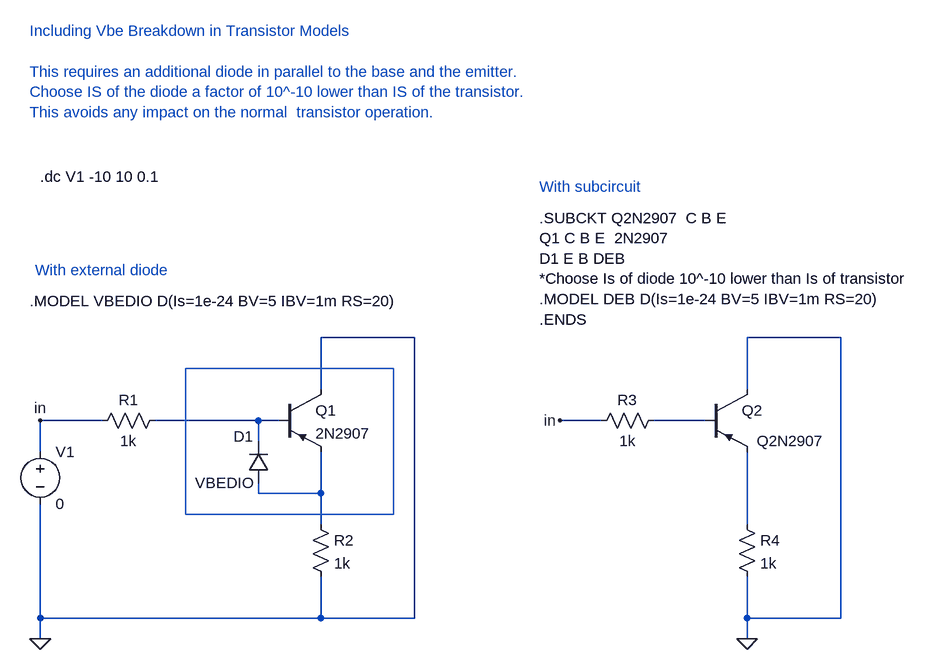
[diagram p0: schematic Vbe_break.asc]
Vbe_break.asc, the LTspice schematic file:
Version 4
SHEET 1 1480 744
WIRE 304 224 304 288
WIRE 304 480 -128 480
WIRE 208 208 208 176
WIRE 208 176 240 176
WIRE 208 176 48 176
WIRE -128 480 -128 304
WIRE -128 176 -128 224
WIRE -32 176 -128 176
WIRE -128 512 -128 480
WIRE 304 128 304 48
WIRE 304 48 448 48
WIRE 448 48 448 480
WIRE 448 480 304 480
WIRE 304 416 304 480
WIRE 208 272 208 288
WIRE 208 288 304 288
WIRE 304 288 304 336
WIRE 960 224 960 336
WIRE 816 176 896 176
WIRE 960 128 960 48
WIRE 960 48 1104 48
WIRE 1104 48 1104 480
WIRE 1104 480 960 480
WIRE 960 416 960 480
WIRE 736 176 672 176
WIRE 960 512 960 480
FLAG -128 512 0
FLAG -128 176 in
FLAG 672 176 in
FLAG 960 512 0
SYMBOL diode 224 272 R180
WINDOW 0 24 72 Left 0
WINDOW 3 24 0 Left 0
SYMATTR InstName D1
SYMATTR Value VBEDIO
SYMBOL pnp 240 128 R0
SYMATTR InstName Q1
SYMATTR Value 2N2907
SYMBOL voltage -128 208 R0
SYMATTR InstName V1
SYMATTR Value 0
SYMBOL res -48 192 R270
WINDOW 0 32 56 VTop 0
WINDOW 3 0 56 VBottom 0
SYMATTR InstName R1
SYMATTR Value 1k
SYMBOL res 288 320 R0
SYMATTR InstName R2
SYMATTR Value 1k
SYMBOL res 720 192 R270
WINDOW 0 32 56 VTop 0
WINDOW 3 0 56 VBottom 0
SYMATTR InstName R3
SYMATTR Value 1k
SYMBOL res 944 320 R0
SYMATTR InstName R4
SYMATTR Value 1k
SYMBOL pnp 896 128 R0
WINDOW 3 79 79 Left 0
SYMATTR Value Q2N2907
SYMATTR InstName Q2
SYMATTR Prefix X
TEXT -128 -200 Left 0 !.dc V1 -10 10 0.1
TEXT -144 -8 Left 0 !.MODEL VBEDIO D(Is=1e-24 BV=5 IBV=1m RS=20)
TEXT 640 -136 Left 0 !.SUBCKT Q2N2907  C B E\nQ1 C B E  2N2907\nD1 E B DEB\n*Choose Is of diode 10^-10 lower than Is of transistor\n.MODEL DEB D(Is=1e-24 BV=5 IBV=1m RS=20)\n.ENDS
TEXT -136 -56 Left 0 ;With external diode
TEXT 640 -184 Left 0 ;With subcircuit
TEXT -144 -424 Left 0 ;Including Vbe Breakdown in Transistor Models\n \nThis requires an additional diode in parallel to the base and the emitter.\nChoose IS of the diode a factor of 10^-10 lower than IS of the transistor. \nThis avoids any impact on the normal  transistor operation.
RECTANGLE Normal 416 320 96 96

The netlist it stands for:
* Vbe_break.asc
D1 N001 N002 VBEDIO
Q1 0 N002 N001 0 2N2907
V1 in 0 0
R1 in N002 1k
R2 N001 0 1k
R3 in N004 1k
R4 N003 0 1k
XQ2 0 N004 N003 Q2N2907  ; pins C B E
.model D D
.lib standard.dio
.model NPN NPN
.model PNP PNP
.lib standard.bjt
.dc V1 -10 10 0.1
.MODEL VBEDIO D(Is=1e-24 BV=5 IBV=1m RS=20)
.SUBCKT Q2N2907  C B E
Q1 C B E  2N2907
D1 E B DEB
*Choose Is of diode 10^-10 lower than Is of transistor
.MODEL DEB D(Is=1e-24 BV=5 IBV=1m RS=20)
.ENDS
* With external diode
* With subcircuit
* Including Vbe Breakdown in Transistor Models
* This requires an additional diode in parallel to the base and the emitter.
* Choose IS of the diode a factor of 10^-10 lower than IS of the transistor.
* This avoids any impact on the normal  transistor operation.
.backanno
.end